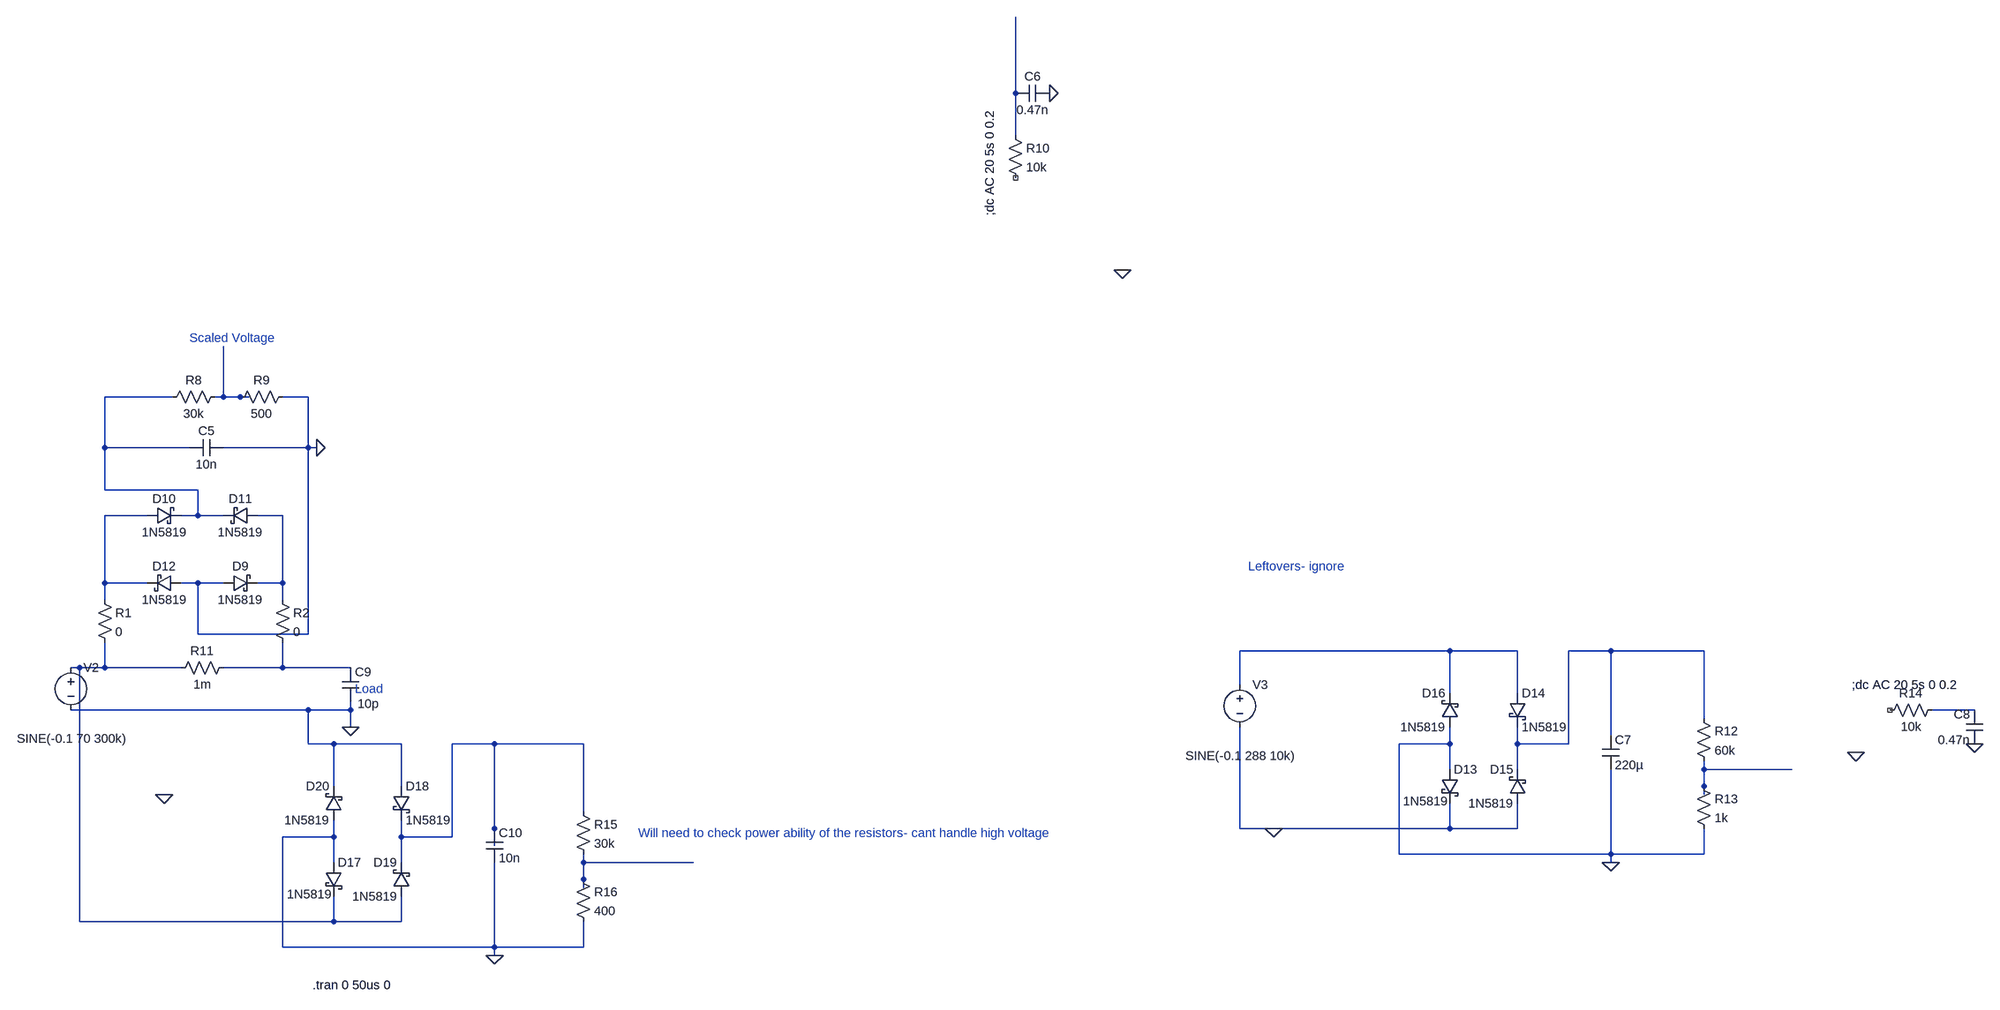
[diagram p0: schematic Full bridge rectifier.asc]
Full bridge rectifier.asc, the LTspice schematic file:
Version 4
SHEET 1 6900 1572
WIRE 4144 -720 4144 -864
WIRE 4144 -640 4144 -720
WIRE 2544 -64 2416 -64
WIRE 2640 -64 2640 -160
WIRE 2640 -64 2624 -64
WIRE 2672 -64 2640 -64
WIRE 2688 -64 2672 -64
WIRE 2800 -64 2752 -64
WIRE 2416 32 2416 -64
WIRE 2576 32 2416 32
WIRE 2800 32 2800 -64
WIRE 2800 32 2640 32
WIRE 2816 32 2800 32
WIRE 2416 112 2416 32
WIRE 2592 112 2416 112
WIRE 2496 160 2416 160
WIRE 2592 160 2592 112
WIRE 2592 160 2560 160
WIRE 2640 160 2592 160
WIRE 2752 160 2704 160
WIRE 2416 288 2416 160
WIRE 2496 288 2416 288
WIRE 2592 288 2560 288
WIRE 2640 288 2592 288
WIRE 2752 288 2752 160
WIRE 2752 288 2704 288
WIRE 2416 320 2416 288
WIRE 2752 320 2752 288
WIRE 2592 384 2592 288
WIRE 2800 384 2800 32
WIRE 2800 384 2592 384
WIRE 5424 416 5024 416
WIRE 5552 416 5424 416
WIRE 5728 416 5648 416
WIRE 5904 416 5728 416
WIRE 2368 448 2352 448
WIRE 2416 448 2416 400
WIRE 2416 448 2368 448
WIRE 2560 448 2416 448
WIRE 2752 448 2752 400
WIRE 2752 448 2640 448
WIRE 2880 448 2752 448
WIRE 5024 480 5024 416
WIRE 5424 496 5424 416
WIRE 5552 496 5552 416
WIRE 2800 528 2352 528
WIRE 2880 528 2880 512
WIRE 2880 528 2800 528
WIRE 6880 528 6800 528
WIRE 5904 544 5904 416
WIRE 2880 560 2880 528
WIRE 5728 576 5728 416
WIRE 2800 592 2800 528
WIRE 2848 592 2800 592
WIRE 2976 592 2848 592
WIRE 3152 592 3072 592
WIRE 3328 592 3152 592
WIRE 5424 592 5424 560
WIRE 5424 592 5328 592
WIRE 5552 592 5552 560
WIRE 5648 592 5648 416
WIRE 5648 592 5552 592
WIRE 5424 640 5424 592
WIRE 5552 640 5552 592
WIRE 5904 640 5904 624
WIRE 6112 640 5904 640
WIRE 2848 672 2848 592
WIRE 2976 672 2976 592
WIRE 5904 672 5904 640
WIRE 5904 688 5904 672
WIRE 3328 720 3328 592
WIRE 3152 752 3152 592
WIRE 5024 752 5024 560
WIRE 5088 752 5024 752
WIRE 5424 752 5424 704
WIRE 5424 752 5088 752
WIRE 5552 752 5552 704
WIRE 5552 752 5424 752
WIRE 2848 768 2848 736
WIRE 2848 768 2752 768
WIRE 2976 768 2976 736
WIRE 3072 768 3072 592
WIRE 3072 768 2976 768
WIRE 3152 784 3152 752
WIRE 5328 800 5328 592
WIRE 5728 800 5728 640
WIRE 5728 800 5328 800
WIRE 5904 800 5904 752
WIRE 5904 800 5728 800
WIRE 2848 816 2848 768
WIRE 2976 816 2976 768
WIRE 3328 816 3328 800
WIRE 3536 816 3328 816
WIRE 5728 816 5728 800
WIRE 3328 848 3328 816
WIRE 3328 864 3328 848
WIRE 2368 928 2368 448
WIRE 2848 928 2848 880
WIRE 2848 928 2368 928
WIRE 2976 928 2976 880
WIRE 2976 928 2848 928
WIRE 2752 976 2752 768
WIRE 3152 976 3152 816
WIRE 3152 976 2752 976
WIRE 3328 976 3328 928
WIRE 3328 976 3152 976
WIRE 3152 992 3152 976
FLAG 2816 32 0
FLAG 4208 -720 0
FLAG 4416 -304 0
FLAG 5728 816 0
FLAG 6880 592 0
FLAG 6656 608 0
FLAG 2880 560 0
FLAG 5088 752 0
FLAG 3152 992 0
FLAG 2528 688 0
DATAFLAG 5232 96 ""
SYMBOL schottky 2640 304 R270
WINDOW 0 32 32 VTop 2
WINDOW 3 0 32 VBottom 2
SYMATTR InstName D9
SYMATTR Value 1N5819
SYMATTR Description Diode
SYMATTR Type diode
SYMBOL schottky 2496 176 R270
WINDOW 0 32 32 VTop 2
WINDOW 3 0 32 VBottom 2
SYMATTR InstName D10
SYMATTR Value 1N5819
SYMATTR Description Diode
SYMATTR Type diode
SYMBOL schottky 2704 144 R90
WINDOW 0 0 32 VBottom 2
WINDOW 3 32 32 VTop 2
SYMATTR InstName D11
SYMATTR Value 1N5819
SYMATTR Description Diode
SYMATTR Type diode
SYMBOL schottky 2560 272 R90
WINDOW 0 0 32 VBottom 2
WINDOW 3 32 32 VTop 2
SYMATTR InstName D12
SYMATTR Value 1N5819
SYMATTR Description Diode
SYMATTR Type diode
SYMBOL cap 2576 48 R270
WINDOW 0 32 32 VTop 2
WINDOW 3 0 32 VBottom 2
SYMATTR InstName C5
SYMATTR Value 10n
SYMATTR SpiceLine V=4 Irms=2.7 Rser=0.035 Lser=0
SYMBOL res 2528 -48 R270
WINDOW 0 32 56 VTop 2
WINDOW 3 0 56 VBottom 2
SYMATTR InstName R8
SYMATTR Value 30k
SYMBOL res 2656 -48 R270
WINDOW 0 32 56 VTop 2
WINDOW 3 0 56 VBottom 2
SYMATTR InstName R9
SYMATTR Value 500
SYMBOL cap 4208 -736 R90
WINDOW 0 0 32 VBottom 2
WINDOW 3 32 32 VTop 2
SYMATTR InstName C6
SYMATTR Value 0.47n
SYMBOL res 4128 -656 R0
SYMATTR InstName R10
SYMATTR Value 10k
SYMBOL res 2656 432 R90
WINDOW 0 0 56 VBottom 2
WINDOW 3 32 56 VTop 2
SYMATTR InstName R11
SYMATTR Value 1m
SYMBOL voltage 2352 432 R0
WINDOW 3 -102 150 Left 2
WINDOW 123 24 124 Left 2
WINDOW 39 0 0 Left 0
SYMATTR Value SINE(-0.1 70 300k)
SYMATTR InstName V2
SYMBOL schottky 5408 640 R0
WINDOW 3 -72 60 Left 2
SYMATTR Value 1N5819
SYMATTR InstName D13
SYMATTR Description Diode
SYMATTR Type diode
SYMBOL schottky 5536 496 R0
SYMATTR InstName D14
SYMATTR Value 1N5819
SYMATTR Description Diode
SYMATTR Type diode
SYMBOL schottky 5568 704 R180
WINDOW 0 24 64 Left 2
WINDOW 3 24 0 Left 2
SYMATTR InstName D15
SYMATTR Value 1N5819
SYMATTR Description Diode
SYMATTR Type diode
SYMBOL schottky 5440 560 R180
WINDOW 0 24 64 Left 2
WINDOW 3 24 0 Left 2
SYMATTR InstName D16
SYMATTR Value 1N5819
SYMATTR Description Diode
SYMATTR Type diode
SYMBOL cap 5712 576 R0
SYMATTR InstName C7
SYMATTR Value 220µ
SYMATTR SpiceLine V=4 Irms=2.7 Rser=0.035 Lser=0
SYMBOL res 5888 528 R0
SYMATTR InstName R12
SYMATTR Value 60k
SYMBOL res 5888 656 R0
SYMATTR InstName R13
SYMATTR Value 1k
SYMBOL cap 6896 592 R180
WINDOW 0 24 56 Left 2
WINDOW 3 24 8 Left 2
SYMATTR InstName C8
SYMATTR Value 0.47n
SYMBOL res 6816 512 R90
WINDOW 0 0 56 VBottom 2
WINDOW 3 32 56 VTop 2
SYMATTR InstName R14
SYMATTR Value 10k
SYMBOL cap 2864 448 R0
WINDOW 3 29 68 Left 2
SYMATTR Value 10p
SYMATTR InstName C9
SYMBOL voltage 5024 464 R0
WINDOW 3 -102 150 Left 2
WINDOW 123 24 124 Left 2
WINDOW 39 0 0 Left 0
SYMATTR Value SINE(-0.1 288 10k)
SYMATTR InstName V3
SYMBOL schottky 2832 816 R0
WINDOW 3 -72 60 Left 2
SYMATTR Value 1N5819
SYMATTR InstName D17
SYMATTR Description Diode
SYMATTR Type diode
SYMBOL schottky 2960 672 R0
SYMATTR InstName D18
SYMATTR Value 1N5819
SYMATTR Description Diode
SYMATTR Type diode
SYMBOL schottky 2992 880 R180
WINDOW 0 24 64 Left 2
WINDOW 3 24 0 Left 2
SYMATTR InstName D19
SYMATTR Value 1N5819
SYMATTR Description Diode
SYMATTR Type diode
SYMBOL schottky 2864 736 R180
WINDOW 0 24 64 Left 2
WINDOW 3 24 0 Left 2
SYMATTR InstName D20
SYMATTR Value 1N5819
SYMATTR Description Diode
SYMATTR Type diode
SYMBOL cap 3136 752 R0
SYMATTR InstName C10
SYMATTR Value 10n
SYMATTR SpiceLine V=4 Irms=2.7 Rser=0.035 Lser=0
SYMBOL res 3312 704 R0
SYMATTR InstName R15
SYMATTR Value 30k
SYMBOL res 3312 832 R0
SYMATTR InstName R16
SYMATTR Value 400
SYMBOL res 2400 304 R0
SYMATTR InstName R1
SYMATTR Value 0
SYMBOL res 2736 304 R0
SYMATTR InstName R2
SYMATTR Value 0
TEXT 4096 -488 VLeft 2 !;dc AC 20 5s 0 0.2
TEXT 6648 480 Left 2 !;dc AC 20 5s 0 0.2
TEXT 2888 488 Left 2 ;Load
TEXT 2576 -176 Left 2 ;Scaled Voltage
TEXT 2808 1048 Left 2 !.tran 0 50us 0
TEXT 5040 256 Left 2 ;Leftovers- ignore
TEXT 3432 760 Left 2 ;Will need to check power ability of the resistors- cant handle high voltage

The netlist it stands for:
* Full bridge rectifier.asc
D9 0 N005 1N5819
D10 N004 N002 1N5819
D11 N005 N002 1N5819
D12 0 N004 1N5819
C5 N002 0 10n V=4 Irms=2.7 Rser=0.035 Lser=0
R8 N002 N003 30k
R9 N003 0 500
C6 0 N001 0.47n
R10 N001 NC_01 10k
R11 N009 N008 1m
V2 N008 0 SINE(-0.1 70 300k)
D13 0 0 1N5819
D14 N006 N007 1N5819
D15 0 N007 1N5819
D16 0 N006 1N5819
C7 N007 0 220µ V=4 Irms=2.7 Rser=0.035 Lser=0
R12 N007 N012 60k
R13 N012 0 1k
C8 0 N010 0.47n
R14 N010 NC_02 10k
C9 N009 0 10p
V3 N006 0 SINE(-0.1 288 10k)
D17 0 N008 1N5819
D18 0 N011 1N5819
D19 N008 N011 1N5819
D20 0 0 1N5819
C10 N011 0 10n V=4 Irms=2.7 Rser=0.035 Lser=0
R15 N011 N013 30k
R16 N013 0 400
R1 N004 N008 0
R2 N005 N009 0
.model D D
.lib standard.dio
;dc AC 20 5s 0 0.2
;dc AC 20 5s 0 0.2
* Load
* Scaled Voltage
.tran 0 50us 0
* Leftovers- ignore
* Will need to check power ability of the resistors- cant handle high voltage
.backanno
.end